# Altium project AQB-5-ANTON_TRANS-PWR.PrjPcb
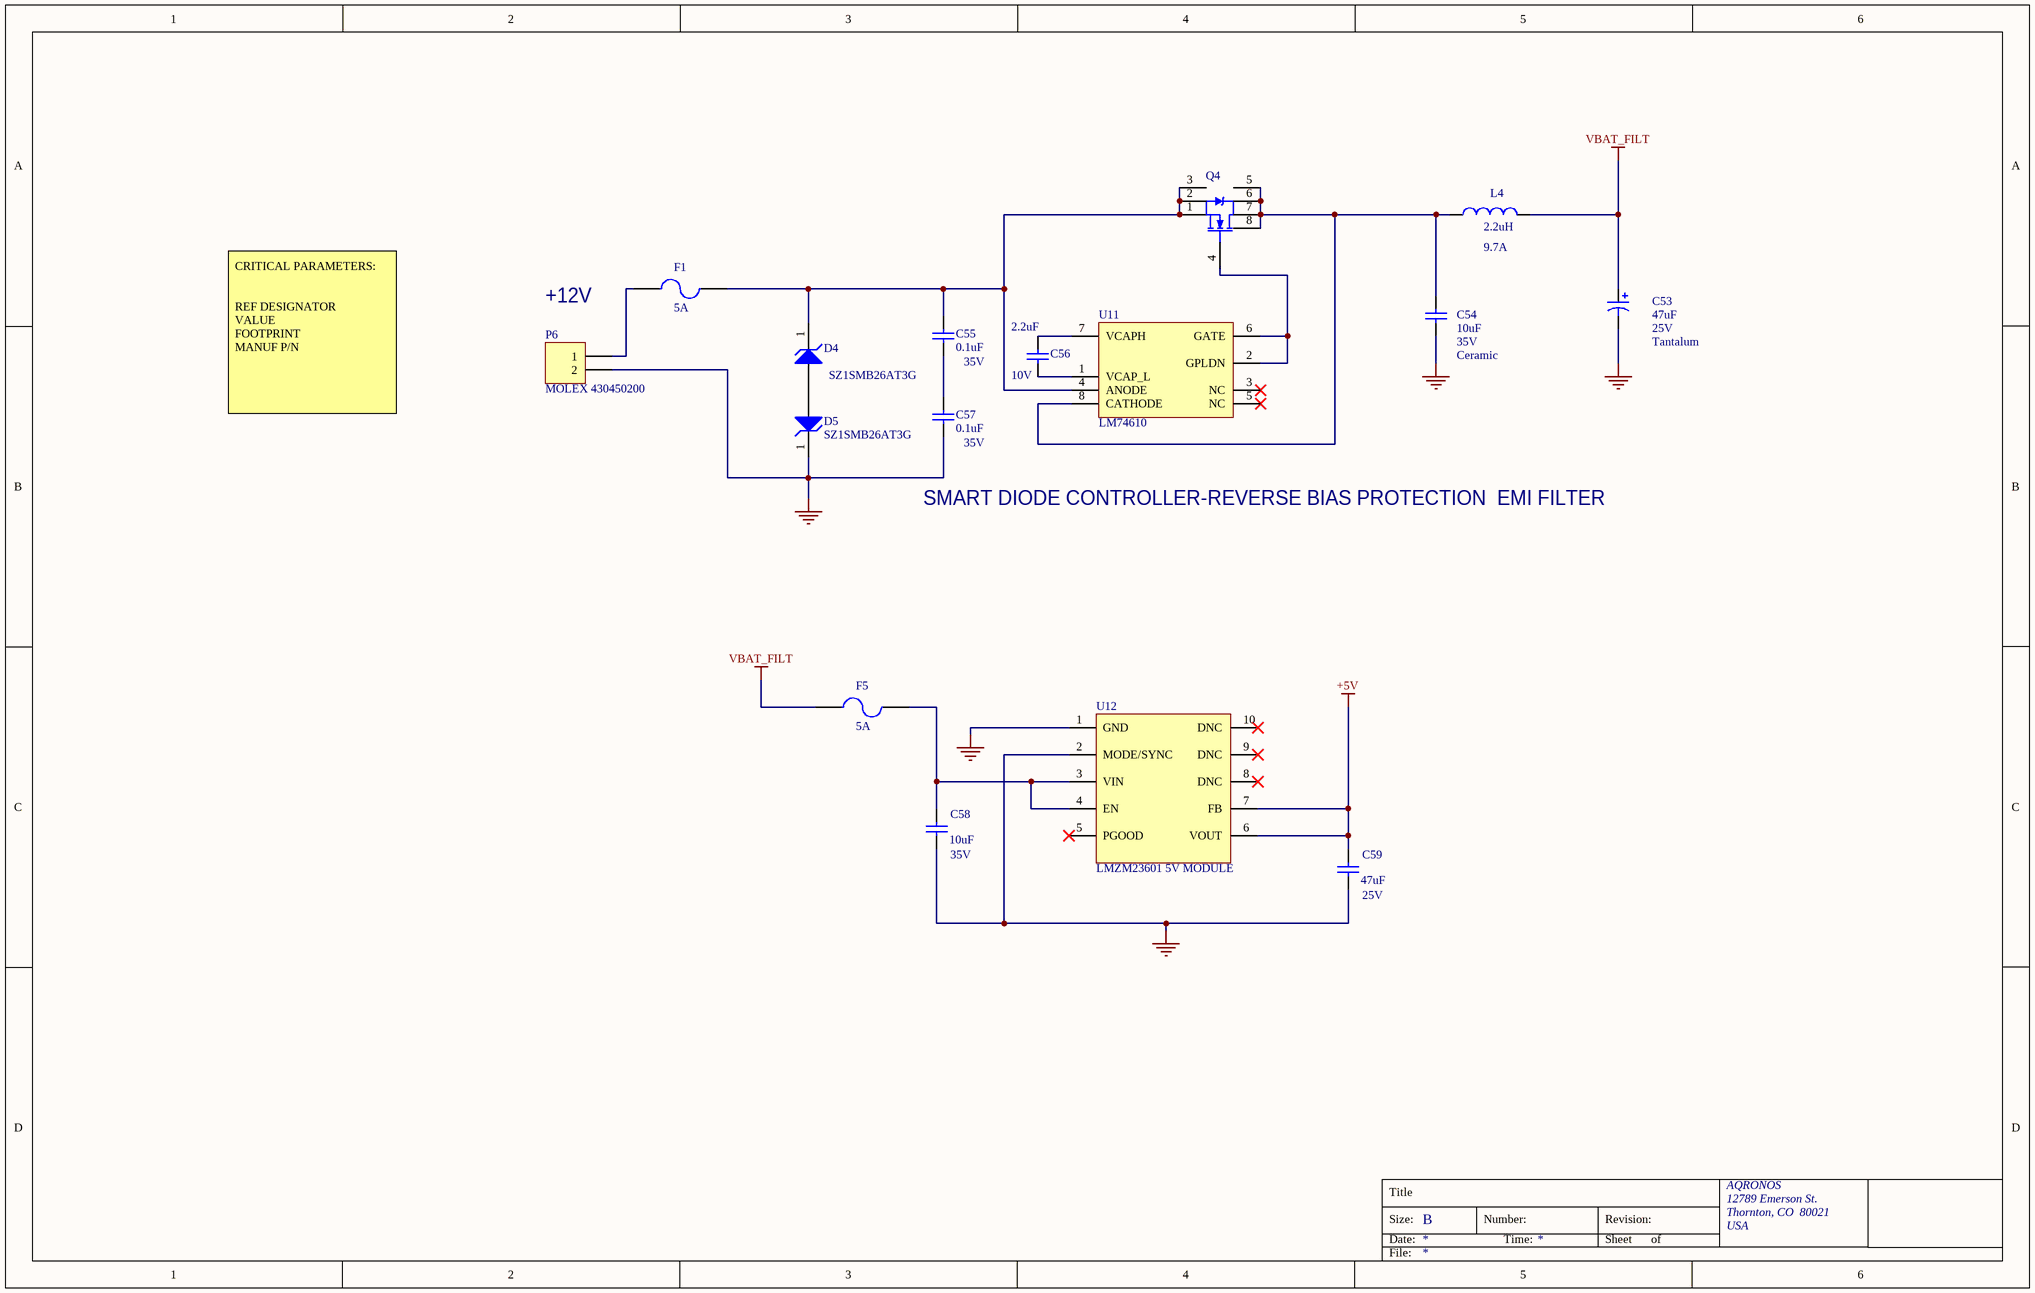
[diagram p0: -NEW_AQB-5-ANTON_TRANS-PWR-TVS.SchDoc]
4 sheets, 138 parts. Net scope: flat (ports and power ports of the same name join across sheets).
Board file: NEW-AQB-5-ANTON_TRANS-PWR.PcbDoc
Sheets:
  -NEW_AQB-5-ANTON_TRANS-PWR-TVS.SchDoc
  -NEW-AQB-5-ANTON_TRANS-PWR-GALVO.SchDoc
  -NEW-AQB-5-ANTON_TRANS-PWR-POLYGON.SchDoc
  -NEW-AQB-5-ANTON_TRANS-PWR_Motion-Controller.SchDoc

## Sheet -NEW_AQB-5-ANTON_TRANS-PWR-TVS.SchDoc
size B; Organization: AQRONOS; Address1: 12789 Emerson St.; Address2: Thornton, CO  80021; Address3: USA

### Parts
C53  Tantalum  value 47uF  Voltage: 25V  [C2917]
C54  Ceramic  value 10uF  Voltage: 35V  [CAP1206]
C55  value 0.1uF  Voltage: 35V  [CAP0603]  (hidden comment: Capacitor_non_pol)
C56  value 2.2uF  Voltage: 10V  [CAP0603]  (hidden comment: Capacitor_non_pol)
C57  value 0.1uF  Voltage: 35V  [CAP0603]  (hidden comment: Capacitor_non_pol)
C58  value 10uF  Voltage: 35V  [CAP1206]  (hidden comment: Capacitor_non_pol)
C59  value 47uF  Voltage: 25V  [CAP1206]  (hidden comment: Capacitor_non_pol)
D4  Manufacturer Part Number: SZ1SMB26AT3G  (hidden comment: Diode Zener)
D5  Manufacturer Part Number: SZ1SMB26AT3G  (hidden comment: Diode Zener)
F1  Current: 5A  [RES0603]  (hidden comment: Fuse)
F5  Current: 5A  [RES0603]  (hidden comment: Fuse)
L4  value 2.2uH  Current: 9.7A  (hidden comment: Inductor)
P6  MOLEX 430450200  [RA-HDR1X2]
Q4  CSD18531Q5A  (value not drawn)
U11  LM74610  [8-TSSOP-VSSOP]
U12  LMZM23601 5V MODULE

### Nets
+5V: C59.1 U12.6(VOUT) U12.7(FB)
GND: C53.2 C54.2 C57.1 C58.2 C59.2 D5.1(K) P6.2 U12.1(GND) U12.2(MODE/SYNC)
VBAT_FILT: C53.1 F5.1 L4.2
NetC54_1: C54.1 L4.1 Q4.5(D) Q4.6(D) Q4.7(D) Q4.8(D) U11.8(CATHODE)
NetC55_1: C55.1 C57.2
NetC55_2: C55.2 D4.1(K) F1.2 Q4.1(S) Q4.2(S) Q4.3(S) U11.4(ANODE)
NetC56_1: C56.1 U11.1(VCAP_L)
NetC56_2: C56.2 U11.7(VCAPH)
NetC58_1: C58.1 F5.2 U12.3(VIN) U12.4(EN)
NetD4_2: D4.2(A) D5.2(A)
NetF1_1: F1.1 P6.1
NetQ4_4: Q4.4(G) U11.2(GPLDN) U11.6(GATE)

Not connected (* = marked no-connect by the designer): U11 3(NC)* 5(NC)*; U12 5(PGOOD)* 8(DNC)* 9(DNC)* 10(DNC)*

### Notes on the sheet
- +12V
- CRITICAL PARAMETERS:
  REF DESIGNATOR
  VALUE
  FOOTPRINT
  MANUF P/N
- SMART DIODE CONTROLLER-REVERSE BIAS PROTECTION
- EMI FILTER
- Title
- Size:
- Date:
- B
- Number:
- Time:
- Revision:
- Sheet
- of
- File:

### Library data of the parts
C53 = Capacitor-Polarized: CAP TANT 47UF 20% 25V 2917; Manufacturer Part Number: TPSD476M025R0250; Distributor Part Number: 478-4120-1-ND; Footprint: 2917; HelpURL: *; P/N: *; Tolerance: *; Vendor: *; Current: *; Power: *; Manufacturer: *
C54 = Capacitor_non_pol: CAP CER 10UF 35V X7R 1206; Manufacturer Part Number: CGA5L1X7R1V106K160AC; Distributor Part Number: 445-174428-1-ND; Footprint: 1206; P/N: *; Tolerance: *; Vendor: *; Manufacturer: *; Power: *; Current: *
C55 C57 = Capacitor_non_pol: CAP CER 0.1UF 35V X7R 0603; Manufacturer Part Number: GMK107B7104KAHT; Distributor Part Number: 587-3354-1-ND; Footprint: 0603; P/N: *; Tolerance: *; Vendor: *; Manufacturer: *; Power: *; Current: *
C56 = Capacitor_non_pol: CAP CER 2.2UF 10V X7R 0603; Manufacturer Part Number: GRM188R71A225KE15D; Footprint: 0603; P/N: *; Tolerance: *; Vendor: *; Distributor Part Number: 490-4520-1-ND
C58 = Capacitor_non_pol: Manufacturer Part Number: C2012X5R1V106K085AC; Distributor Part Number: 445-14417-1-ND; Footprint: *; P/N: *; Tolerance: *; Vendor: *; Manufacturer: *; Power: *; Current: *
C59 = Capacitor_non_pol: Manufacturer Part Number: GRM31CR61E476ME44L; Distributor Part Number: 490-16268-1-ND; Footprint: *; P/N: *; Tolerance: *; Vendor: *; Manufacturer: *; Power: *; Current: *
D4 D5 = Diode Zener: TVS DIODE 26V 42.1V SMB; Published: 8-Jun-2000; LatestRevisionDate: 17-Jul-2002; LatestRevisionNote: Re-released for DXP Platform.; PackageReference: DIODE-0.7; Publisher: Altium Limited; Distributor Part Number: F11556CT-ND; Vendor: *; Voltage: *; Power: *; Current: *; Tolerance: *; Manufacturer: *; Footprint: DO-214AA SMB
F1 F5 = Fuse: FUSE BOARD MNT 5A 32VAC/VDC 0603; Manufacturer Part NUmber: TR/0603FA5-R; Manufacturer: Eaton; Published: 8-Jun-2000; LatestRevisionDate: 17-Jul-2002; LatestRevisionNote: Re-released for DXP Platform.; PackageReference: PIN-W2/E2.8; Publisher: Altium Limited; Vendor: *; Distributor Part Number: 283-2564-1-ND; Voltage: *; Power: *; Tolerance: *; Footprint: 0603
L4 = Inductor: Fixed Inductor 2.2uH 20% 9.7A 14.5mOhms AEC-Q200; Manufacturer: Coilcraft; Manufacturer Part Number: XAL5030-222MEB; Vendor: Mouser; Distributor Part Number: 994-XAL5030-222MEB; HelpURL: *; Tolerance: 20%; Voltage: *; Power: *
P6 = HDR1x2-430450200: Connector Header Through Hole, Right Angle 2 position; Manufacturer Part Number: 0430450200; Footprint: RA-HDR1x2; P/N: *; Tolerance: *; Value: *; Vendor: Molex; Distributor Part Number: WM1813-ND
Q4 = CSD18531Q5A: N-Channel 2.5V (G-S) MOSFET; Rule: PcbType=ProtelPcb; Published: 8-Jun-2000; LatestRevisionDate: 17-Jul-2002; LatestRevisionNote: Re-released for DXP Platform.; DatasheetVersion: 6-Oct-1997; PackageVersion: Aug-1998; PackageReference: TSOP-6; Publisher: Altium Limited; PackageDescription: SOT-457/SC-74; 6 Leads; Body 3.1 x 3 mm, inc. leads (LxW max); ComponentLink1Description: Manufacturer Link; ComponentLink1URL: http://www.vishay.com/; ComponentLink2Description: Datasheet; ComponentLink2URL: http://www.vishay.com/docs/70192/70192.pdf; Manufacturer Part Number: CSD18531Q5A; Distributor Part Number: 296-30573-1-ND; Footprint: TDFN-8
U11 = LM74610: IC SMART DIODE CTLR 8VSSOP; Manufacturer: Texas Instruments; Manufacturer Part Number: LM74610QDGKRQ1; Vendor: *; Distributor Part Number: 296-43067-1-ND; Power: *; Voltage: *; Footprint: 8-TSSOP, 8-MSOP (0.118", 3.00mm Width); Value: *; Tolerance: *
U12 = LMZM23601 5V MODULE: Manufacturer Part Number: LMZM23601V3SILT; Designator: U12; Distributor Part Number: 296-49461-1-ND; Footprint: 10-LDFN EXPOSED PAD

## Sheet -NEW-AQB-5-ANTON_TRANS-PWR-GALVO.SchDoc
size B; Organization: AQRONOS; Address1: 12789 Emerson St.; Address2: Thornton, CO  80021; Address3: USA
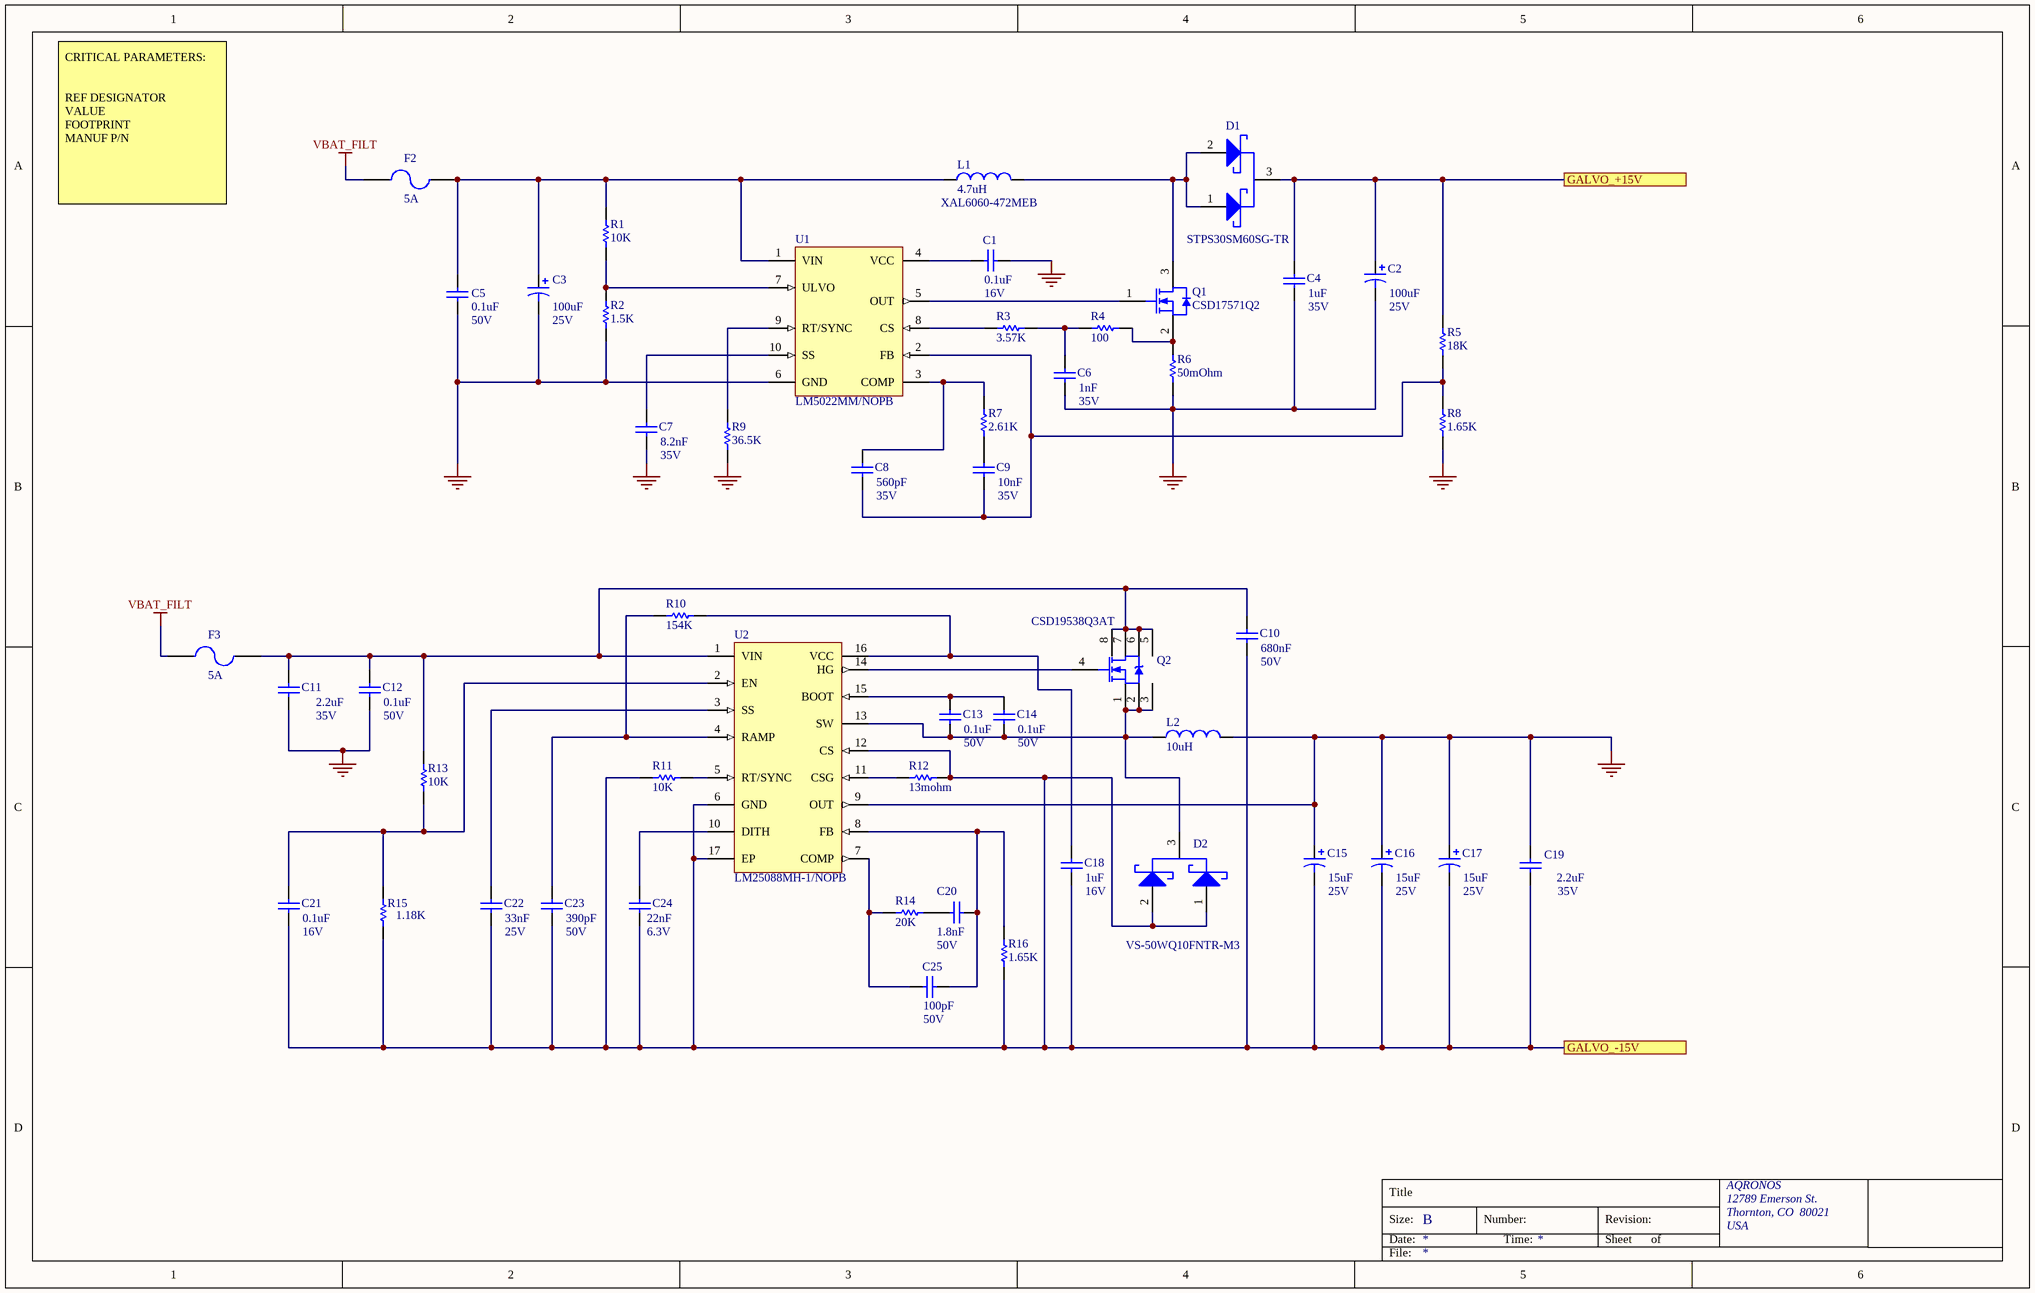
[diagram p1: -NEW-AQB-5-ANTON_TRANS-PWR-GALVO.SchDoc]

### Parts
C1  value 0.1uF  Voltage: 16V  [CAP0402]  (hidden comment: Capacitor_non_pol)
C2  value 100uF  Voltage: 25V  [EEE-FK1H470XP]  (hidden comment: Capacitor-Polarized)
C3  value 100uF  Voltage: 25V  (hidden comment: Capacitor-Polarized)
C4  value 1uF  Voltage: 35V  [CAP0402]  (hidden comment: Capacitor_non_pol)
C5  value 0.1uF  Voltage: 50V  [CAP0402]  (hidden comment: Capacitor_non_pol)
C6  value 1nF  Voltage: 35V  [CAP0402]  (hidden comment: Capacitor_non_pol)
C7  value 8.2nF  Voltage: 35V  [CAP0402]  (hidden comment: Capacitor_non_pol)
C8  value 560pF  Voltage: 35V  [CAP0402]  (hidden comment: Capacitor_non_pol)
C9  value 10nF  Voltage: 35V  [CAP0402]  (hidden comment: Capacitor_non_pol)
C10  value 680nF  Voltage: 50V  [CAP0603]  (hidden comment: Capacitor_non_pol)
C11  value 2.2uF  Voltage: 35V  [CAP0603]  (hidden comment: Capacitor_non_pol)
C12  value 0.1uF  Voltage: 50V  [CAP0805]  (hidden comment: Capacitor_non_pol)
C13  value 0.1uF  Voltage: 50V  [CAP0805]  (hidden comment: Capacitor_non_pol)
C14  value 0.1uF  Voltage: 50V  [CAP0805]  (hidden comment: Capacitor_non_pol)
C15  value 15uF  Voltage: 25V  [EEE-FK1H470XP]  (hidden comment: Capacitor-Polarized)
C16  value 15uF  Voltage: 25V  [EEE-FK1H470XP]  (hidden comment: Capacitor-Polarized)
C17  value 15uF  Voltage: 25V  [EEE-FK1H470XP]  (hidden comment: Capacitor-Polarized)
C18  value 1uF  Voltage: 16V  [CAP0603]  (hidden comment: Capacitor_non_pol)
C19  value 2.2uF  Voltage: 35V  [CAP0603]  (hidden comment: Capacitor_non_pol)
C20  value 1.8nF  Voltage: 50V  [CAP0805]  (hidden comment: Capacitor_non_pol)
C21  value 0.1uF  Voltage: 16V  [CAP0402]  (hidden comment: Capacitor_non_pol)
C22  value 33nF  Voltage: 25V  [CAP0402]  (hidden comment: Capacitor_non_pol)
C23  value 390pF  Voltage: 50V  [CAP0402]  (hidden comment: Capacitor_non_pol)
C24  value 22nF  Voltage: 6.3V  [CAP0402]  (hidden comment: Capacitor_non_pol)
C25  value 100pF  Voltage: 50V  [CAP0805]  (hidden comment: Capacitor_non_pol)
D1  Manufacturer Part Number: STPS30SM60SG-TR  [ONSC-D2PAK-3-418AJ_A_V]  (hidden comment: Schottky-3-Terminal)
D2  VS-50WQ10FNTR-M3  [ONSC-D2PAK-3-418AJ_A_V]
F2  Current: 5A  [RES0603]  (hidden comment: Fuse)
F3  Current: 5A  [RES0603]  (hidden comment: Fuse)
L1  4.7uH  Manufacturer Part Number: XAL6060-472MEB  [PA4320.104NLT]
L2  10uH  [PA4320.104NLT]
Q1  CSD17571Q2  [NXP-SOT23_N]
Q2  CSD19538Q3AT  [CSD18531Q5A-3D]
R1  value 10K  [RES0402]  (hidden comment: Resistor)
R2  value 1.5K  [RES0402]  (hidden comment: Resistor)
R3  value 3.57K  [RES0402]  (hidden comment: Resistor)
R4  value 100  [RES0402]  (hidden comment: Resistor)
R5  value 18K  [RES0603]  (hidden comment: Resistor)
R6  value 50mOhm  [RES1206]  (hidden comment: Resistor)
R7  value 2.61K  [RES0402]  (hidden comment: Resistor)
R8  value 1.65K  [RES0402]  (hidden comment: Resistor)
R9  value 36.5K  [RES0402]  (hidden comment: Resistor)
R10  value 154K  [RES0402]  (hidden comment: Resistor)
R11  value 10K  [RES0402]  (hidden comment: Resistor)
R12  value 13mohm  [RES0402]  (hidden comment: Resistor)
R13  value 10K  [RES0402]  (hidden comment: Resistor)
R14  value 20K  [RES0402]  (hidden comment: Resistor)
R15  value 1.18K  [RES0402]  (hidden comment: Resistor)
R16  value 1.65K  [RES0402]  (hidden comment: Resistor)
U1  LM5022MM/NOPB  [MUB10A_N]
U2  LM25088MH-1/NOPB  [MXA16A_N]

### Ports
GALVO_+15V, GALVO_-15V

### Nets
GND: C1.2 C2.2 C3.2 C4.2 C5.2 C6.2 C7.2 C11.2 C12.1 C15.1 C16.1 C17.1 C19.1 L2.2 R2.2 R6.1 R8.1 R9.2 U1.6(GND) U2.9(OUT)
VBAT_FILT: F2.1 F3.1
NetC1_1: C1.1 U1.4(VCC)
NetC2_1: C2.1 C4.1 D1.3(K) R5.1 ; port GALVO_+15V
NetC3_1: C3.1 C5.1 F2.2 L1.1 R1.1 U1.1(VIN)
NetC6_1: C6.1 R3.2 R4.1
NetC7_1: C7.1 U1.10(SS)
NetC8_1: C8.1 C9.1 R5.2 R8.2 U1.2(FB)
NetC8_2: C8.2 R7.2 U1.3(COMP)
NetC9_2: C9.2 R7.1
NetC10_1: C10.1 C11.1 C12.2 F3.2 Q2.5(D) Q2.6(D) Q2.7(D) Q2.8(D) R13.2 U2.1(VIN)
NetC10_2: C10.2 C15.2 C16.2 C17.2 C18.2 C19.2 C21.2 C22.2 C23.2 C24.2 D2.1(A) D2.2(A) R11.2 R12.2 R15.1 R16.1 U2.6(GND) U2.12(CS) U2.17(EP) ; port GALVO_-15V
NetC13_1: C13.1 C14.1 D2.3(K) L2.1 Q2.1(S) Q2.2(S) Q2.3(S) U2.13(SW)
NetC13_2: C13.2 C14.2 U2.15(BOOT)
NetC18_1: C18.1 R10.1 U2.16(VCC)
NetC20_1: C20.1 R14.1
NetC20_2: C20.2 C25.2 R16.2 U2.8(FB)
NetC21_1: C21.1 R13.1 R15.2 U2.2(EN)
NetC22_1: C22.1 U2.3(SS)
NetC23_1: C23.1 R10.2 U2.4(RAMP)
NetC24_1: C24.1 U2.10(DITH)
NetC25_1: C25.1 R14.2 U2.7(COMP)
NetD1_1: D1.1(A) D1.2(A) L1.2 Q1.3(D)
NetQ1_1: Q1.1(G) U1.5(OUT)
NetQ1_2: Q1.2(S) R4.2 R6.2
NetQ2_4: Q2.4(G) U2.14(HG)
NetR1_2: R1.2 R2.1 U1.7(ULVO)
NetR3_1: R3.1 U1.8(CS)
NetR9_1: R9.1 U1.9(RT/SYNC)
NetR11_1: R11.1 U2.5(RT/SYNC)
NetR12_1: R12.1 U2.11(CSG)

### Notes on the sheet
- CRITICAL PARAMETERS:
  REF DESIGNATOR
  VALUE
  FOOTPRINT
  MANUF P/N
- Title
- Size:
- Date:
- B
- Number:
- Time:
- Revision:
- Sheet
- of
- File:

### Library data of the parts
C1 C21 = Capacitor_non_pol: CAP CER 0.1UF 16V X7R 0402; Manufacturer Part Number: GRM155R71C104KA88D; Distributor Part Number: 490-3261-1-ND; Footprint: *; P/N: *; Tolerance: *; Vendor: *; Manufacturer: *; Power: *; Current: *; Supplier Part Number 1: 490-3261-1-ND
C2 = Capacitor-Polarized: CAP ALUM POLY 100UF 20% 25V SMD; Manufacturer Part Number: 25SVPF100M; Distributor Part Number: P123675CT-ND; Footprint: *; HelpURL: *; P/N: *; Tolerance: *; Vendor: *; Current: *; Power: *; Manufacturer: *; Supplier Part Number 1: P123675CT-ND
C3 = Capacitor-Polarized: CAP ALUM POLY HYB 100UF 25V SMD; Manufacturer Part Number: EEHZA1E101XP; Distributor Part Number: P15436CT-ND; Footprint: SMT Radial Can; HelpURL: *; P/N: *; Tolerance: *; Vendor: *; Current: *; Power: *; Manufacturer: *; Supplier Part Number 1: P15436CT-ND
C4 = Capacitor_non_pol: CAP CER 1UF 35V X5R 0402; Manufacturer Part Number: C1005X5R1V105K050BC; Distributor Part Number: 445-9073-1-ND; Footprint: *; P/N: *; Tolerance: *; Vendor: *; Manufacturer: *; Power: *; Current: *; Supplier Part Number 1: 445-9073-1-ND; Vendor Part Number: *
C5 = Capacitor_non_pol: CAP CER 0.1UF 50V X5R 0402; Manufacturer Part Number: C1005X5R1H104K050BB; Distributor Part Number: 445-5942-1-ND; Footprint: 0402; P/N: *; Tolerance: *; Vendor: *; Manufacturer: *; Power: *; Current: *; Supplier Part Number 1: 445-5942-1-ND
C6 = Capacitor_non_pol: CAP CER 1000PF 50V C0G/NP0 0402; Manufacturer Part Number: GRM1555C1H102JA01J; Distributor Part Number: 490-6190-1-ND; Footprint: *; P/N: *; Tolerance: *; Vendor: *; Manufacturer: *; Power: *; Current: *; Supplier Part Number 1: 490-6190-1-ND
C7 = Capacitor_non_pol: CAP CER 8200PF 25V X7R 0402; Manufacturer Part Number: GRM155R71E822KA01D; Distributor Part Number: 490-1311-1-ND; Footprint: 0402; P/N: *; Tolerance: *; Vendor: *; Manufacturer: *; Power: *; Current: *; Supplier Part Number 1: 490-1311-1-ND
C8 = Capacitor_non_pol: CAP CER 560PF 50V C0G/NP0 0402; Manufacturer Part Number: GRM1555C1H561JA01J; Distributor Part Number: 490-6248-1-ND; Footprint: *; P/N: *; Tolerance: *; Vendor: *; Manufacturer: *; Power: *; Current: *; Supplier Part Number 1: 490-6248-1-ND
C9 = Capacitor_non_pol: CAP CER 10000PF 35V X7R 0402; Manufacturer Part Number: CGA2B3X7R1V103K050BB; Distributor Part Number: 445-6900-1-ND; Footprint: *; P/N: *; Tolerance: *; Vendor: *; Manufacturer: *; Power: *; Current: *; Supplier Part Number 1: 445-6900-1-ND
C10 = Capacitor_non_pol: CAP CER 0.68UF 50V X5R 0603; Manufacturer Part Number: C1608X5R1H684K080AB; Distributor Part Number: 445-12509-1-ND; Footprint: *; P/N: *; Tolerance: *; Vendor: *; Manufacturer: *; Power: *; Current: *; Supplier Part Number 1: 445-12509-1-ND
C11 C19 = Capacitor_non_pol: CAP CER 2.2UF 35V X5R 0603; Manufacturer Part Number: C1608X5R1V225K080AC; Distributor Part Number: 445-8025-1-ND; Footprint: *; P/N: *; Tolerance: *; Vendor: *; Manufacturer: *; Power: *; Current: *; Supplier Part Number 1: 445-8025-1-ND
C12-C14 = Capacitor_non_pol: CAP CER 0.1UF 50V X7R 0805; Manufacturer Part Number: CC0805KRX7R9BB104; Distributor Part Number: 311-1140-1-ND; Footprint: *; P/N: *; Tolerance: *; Vendor: *; Manufacturer: *; Power: *; Current: *; Supplier Part Number 1: 311-1140-1-ND
C15-C17 = Capacitor-Polarized: CAP ALUM POLY 15UF 20% 25V SMD; Manufacturer Part Number: 25SVPG15M; Distributor Part Number: P18932CT-ND; Footprint: *; HelpURL: *; P/N: *; Tolerance: *; Vendor: *; Current: *; Power: *; Manufacturer: *; Supplier Part Number 1: P18932CT-ND
C18 = Capacitor_non_pol: CAP CER 1UF 16V X7R 0603; Manufacturer Part Number: EMK107B7105KA-T; Distributor Part Number: 587-1241-1-ND; Footprint: *; P/N: *; Tolerance: *; Vendor: *; Manufacturer: *; Power: *; Current: *; Supplier Part Number 1: 587-1241-1-ND
C20 = Capacitor_non_pol: CAP CER 1800PF 50V C0G 0805; Manufacturer Part Number: CGA4C2C0G1H182J060AA; Distributor Part Number: 445-12616-1-ND; Footprint: *; P/N: *; Tolerance: *; Vendor: *; Manufacturer: *; Power: *; Current: *; Supplier Part Number 1: 445-12616-1-ND
C22 = Capacitor_non_pol: CAP CER 0.033UF 25V X7R 0402; Manufacturer Part Number: GRM155R71E333KA88D; Distributor Part Number: 490-3253-1-ND; Footprint: *; P/N: *; Tolerance: *; Vendor: *; Manufacturer: *; Power: *; Current: *; Supplier Part Number 1: 490-3253-1-ND
C23 = Capacitor_non_pol: CAP CER 390PF 50V C0G/NP0 0402; Manufacturer Part Number: GRM1555C1H391JA01J; Distributor Part Number: 490-6236-1-ND; Footprint: *; P/N: *; Tolerance: *; Vendor: *; Manufacturer: *; Power: *; Current: *; Supplier Part Number 1: 490-6236-1-ND
C24 = Capacitor_non_pol: AP CER 0.022UF 6.3V X5R 0402; Manufacturer Part Number: C0402C223K9PACTU; Distributor Part Number: 399-3014-1-ND; Footprint: *; P/N: *; Tolerance: *; Vendor: *; Manufacturer: *; Power: *; Current: *; Supplier Part Number 1: 399-3014-1-ND
C25 = Capacitor_non_pol: CAP CER 100PF 50V C0G/NP0 0805; Manufacturer Part Number: CL21C101JBANNNC; Distributor Part Number: 1276-1014-1-ND; Footprint: *; P/N: *; Tolerance: *; Vendor: *; Manufacturer: *; Power: *; Current: *; Supplier Part Number 1: 1276-1014-1-ND
D1 = Schottky-3-Terminal: DIODE SCHOTTKY 60V 30A D2PAK; Manufacturer: On Semiconductor; PartNumber: SZP6SMB20AT3G; Direction: Unidirectional; IR Max (uA): 5; Packing: Tape and Reel; PPK Max (W): 600; V(BR) Typ (V): 20; DatasheetVersion: Rev. J; PackageVersion: Rev. J, 07/2012; PackageReference: SMB-2-403A-03_J; PackageDescription: 2-Pin Small Molded Package, J-Bend Lead, Body 4.33 x 3.625 mm; Supplier 1: Digi-Key; Supplier Part Number 1: 497-12329-1-ND; Supplier 2: Mouser; Supplier Part Number 2: 497-12329-1-ND; RoHS: Pb-Free; Mounting Technology: Surface Mount; ComponentLink1Description: Manufacturer URL; ComponentLink1URL: http://www.onsemi.com/; ComponentLink2Description: Datasheet; ComponentLink2URL: http://www.onsemi.com/pub_link/Collateral/P6SMB6.8AT3-D.PDF; ComponentLink3Description: Package Specification; ComponentLink3URL: http://www.onsemi.com/pub_link/Collateral/P6SMB6.8AT3-D.PDF; Distributor Part Number: 497-12329-1-ND; Footprint: D2PAK
D2 = Schottky-3-Terminal: Manufacturer: On Semiconductor; Direction: Unidirectional; IR Max (uA): 5; Packing: Tape and Reel; PPK Max (W): 600; V(BR) Typ (V): 20; DatasheetVersion: Rev. J; PackageVersion: Rev. J, 07/2012; PackageReference: SMB-2-403A-03_J; PackageDescription: 2-Pin Small Molded Package, J-Bend Lead, Body 4.33 x 3.625 mm; Supplier 1: Digi-Key; Supplier Part Number 1: VS-50WQ10FNTR-M3CT-ND; Supplier 2: Mouser; Supplier Part Number 2: VS-50WQ10FNTR-M3CT-ND; RoHS: Pb-Free; Mounting Technology: Surface Mount; PartNumber: VS-50WQ10FNTR-M3; ComponentLink1Description: Manufacturer URL; ComponentLink1URL: http://www.onsemi.com/; ComponentLink2Description: Datasheet; ComponentLink2URL: http://www.onsemi.com/pub_link/Collateral/P6SMB6.8AT3-D.PDF; ComponentLink3Description: Package Specification; ComponentLink3URL: http://www.onsemi.com/pub_link/Collateral/P6SMB6.8AT3-D.PDF; Manufacturer Part Number: VS-50WQ10FNTR-M3; Distributor Part Number: VS-50WQ10FNTR-M3CT-ND
F2 F3 = Fuse: as F1 on sheet -NEW_AQB-5-ANTON_TRANS-PWR-TVS; Published: 8-Jun-2000; LatestRevisionDate: 17-Jul-2002; LatestRevisionNote: Re-released for DXP Platform.; PackageReference: PIN-W2/E2.8; Publisher: Altium Limited; Vendor: *; Distributor Part Number: 283-2564-1-ND; Voltage: *; Power: *; Tolerance: *; Footprint: 0603
L1 = Inductor: Fixed Inductors 4.7uH 20% 11A 14.40mOhms AEC-Q200; Vendor: MOUSER; Distributor Part Number: 994-XAL6060-472MEB; Footprint: *; HelpURL: *; Manufacturer: *; Tolerance: *; Value: *; Current: 11A; Voltage: *; Power: *
L2 = Inductor: FIXED IND 10UH 5A 21 MOHM SMD; Manufacturer Part Number: SRR1208-100ML; Vendor: DIGIKEY; Distributor Part Number: SRR1208-100MLCT-ND; Footprint: *; HelpURL: *; Manufacturer: *; Tolerance: *; Value: *; Current: 5A; Voltage: *; Power: *
Q1 = BSS138P,215: N-Channel Trench MOSFET, 60 V, 0.36 A, -55 to 150 degC, 3-Pin SOT23, Tape and Reel; Manufacturer: NXP Semiconductors; Automotive Qualified: Y; Channel Type: N; ID [max] (A): 0.36; IDM [max] (A): 1.2; Packing: Tape & Reel; VDS [max] (V): 60; DatasheetVersion: Rev. 1; PackageVersion: 06-03-16, 03/2006; PackageReference: SOT23; PackageDescription: 3-Pin Small Outline Transistor Package, Body 2.9 x 1.3 mm, Pitch 0.95 mm; Supplier 1: Digi-Key; Supplier Part Number 1: 568-10308-2-ND; Supplier 2: Digi-Key; Supplier Part Number 2: 568-10308-1-ND; Supplier 3: Digi-Key; Supplier Part Number 3: 568-10308-6-ND; Supplier 4: Newark; Supplier Part Number 4: 54T9070; Supplier 5: Mouser; Supplier Part Number 5: 771-BSS138P215; VGSth [typ] (V): 1.2; Mounting Technology: Surface Mount; Code_JEDEC: TO-236AB; PartNumber: BSS138P,215; ComponentLink1Description: Manufacturer URL; ComponentLink1URL: http://www.nxp.com/; ComponentLink2Description: Datasheet; ComponentLink2URL: http://www.nxp.com/documents/data_sheet/BSS138P.pdf; ComponentLink3Description: Package Specification; ComponentLink3URL: http://www.nxp.com/documents/outline_drawing/sot023_po.pdf; Manufacturer Part Number: CSD17571Q2; Distributor Part Number: 296-37193-1-ND
Q2 = CSD18531Q5A: MOSFET N-CH 100V 15A VSONP; Published: 8-Jun-2000; LatestRevisionDate: 17-Jul-2002; LatestRevisionNote: Re-released for DXP Platform.; DatasheetVersion: 6-Oct-1997; PackageVersion: Aug-1998; PackageReference: VSONP; Publisher: Altium Limited; PackageDescription: SOT-457/SC-74; 6 Leads; Body 3.1 x 3 mm, inc. leads (LxW max); ComponentLink1Description: Manufacturer Link; ComponentLink1URL: http://www.vishay.com/; ComponentLink2Description: Datasheet; ComponentLink2URL: http://www.vishay.com/docs/70192/70192.pdf; Manufacturer Part Number: CSD19538Q3A; Supplier Part Number: 296-44473-1-ND; Distributor Part Number: 296-44473-1-ND
R1 = Resistor: RES SMD 10K OHM 0.5% 1/16W 0402; Manufacturer Part Number: ERA-2AED103X; Distributor Part Number: P10KDECT-ND; Footprint: 0402; HelpURL: *; P/N: *; Tolerance: *; Vendor: *; Voltage: *; Power: *; Current: *; Manufacturer: *; Supplier Part Number 1: P10KDECT-ND
R2 = Resistor: RES SMD 1.5K OHM 1% 1/5W 0402; Manufacturer Part Number: CRCW04021K50FKED; Distributor Part Number: 541-1.50KYCT-ND; Footprint: 0402; HelpURL: *; P/N: *; Tolerance: *; Vendor: *; Voltage: *; Power: *; Current: *; Manufacturer: *; Supplier Part Number 1: 541-1.50KYCT-ND
R3 = Resistor: RES SMD 3.57K OHM 1% 1/16W 0402; Manufacturer Part Number: CRCW04023K57FKED; Distributor Part Number: 541-3.57KLCT-ND; Footprint: *; HelpURL: *; P/N: *; Tolerance: *; Vendor: *; Voltage: *; Power: *; Current: *; Manufacturer: *; Supplier Part Number 1: 541-3.57KLCT-ND
R4 = Resistor: RES SMD 100 OHM 1% 1/16W 0402; Manufacturer Part Number: CRCW0402100RFKED; Distributor Part Number: 541-100LCT-ND; Footprint: *; HelpURL: *; P/N: *; Tolerance: *; Vendor: *; Voltage: *; Power: *; Current: *; Manufacturer: *; Supplier Part Number 1: 541-100LCT-ND
R5 = Resistor: RES SMD 18K OHM 1% 1/10W 0603; Manufacturer Part Number: RC0603FR-0718KL; Distributor Part Number: 311-18.0KHRCT-ND; Footprint: *; HelpURL: *; P/N: *; Vendor: *; Voltage: *; Power: *; Current: *; Manufacturer: *; Supplier Part Number 1: 311-18.0KHRCT-ND
R6 = Resistor: RES 0.05 OHM 1% 1/2W 1206; Manufacturer Part Number: CSR1206FK50L0; Distributor Part Number: CSR1206FK50L0CT-ND; Footprint: *; HelpURL: *; P/N: *; Tolerance: *; Vendor: *; Voltage: *; Power: *; Current: *; Manufacturer: *; Supplier Part Number 1: CSR1206FK50L0CT-ND
R7 = Resistor: RES SMD 2.61K OHM 1% 1/16W 0402; Manufacturer Part Number: CRCW04022K61FKED; Distributor Part Number: 541-2.61KLCT-ND; Footprint: *; HelpURL: *; P/N: *; Tolerance: *; Vendor: *; Voltage: *; Power: *; Current: *; Manufacturer: *; Supplier Part Number 1: 541-2.61KLCT-ND
R8 R16 = Resistor: RES SMD 1.65K OHM 1% 1/16W 0402; Manufacturer Part Number: RCW04021K65FKED; Distributor Part Number: 541-1.65KLCT-ND; Footprint: *; HelpURL: *; P/N: *; Tolerance: *; Vendor: *; Voltage: *; Power: *; Current: *; Manufacturer: *; Supplier Part Number 1: 541-1.65KLCT-ND
R9 = Resistor: RES SMD 36.5KOHM 0.1% 1/16W 0402; Manufacturer Part Number: ERA-2AEB3652X; Distributor Part Number: P36.5KDCCT-ND; Footprint: 0402; HelpURL: *; P/N: *; Tolerance: *; Vendor: *; Voltage: *; Power: *; Current: *; Manufacturer: *; Supplier Part Number 1: P36.5KDCCT-ND
R10 = Resistor: Manufacturer Part Number: CRCW0402154KFKED; Distributor Part Number: 541-154KLCT-ND; Footprint: *; HelpURL: *; P/N: *; Tolerance: *; Vendor: *; Voltage: *; Power: *; Current: *; Manufacturer: *
R11 R13 = Resistor: Manufacturer Part Number: RC0201FR-0710KL; Distributor Part Number: 311-10.0KMCT-ND; Footprint: *; HelpURL: *; P/N: *; Tolerance: *; Vendor: *; Voltage: *; Power: *; Current: *; Manufacturer: *
R12 = Resistor: Manufacturer Part Number: PRL1632-R013-F-T1; Distributor Part Number: PRL1632.013FCT-ND; Footprint: *; HelpURL: *; P/N: *; Tolerance: *; Vendor: *; Voltage: *; Power: *; Current: *; Manufacturer: *
R14 = Resistor: RES SMD 1.65K OHM 1% 1/16W 0402; Manufacturer Part Number: CRCW040220K0FKED; Distributor Part Number: 541-1.65KLCT-ND; Footprint: *; HelpURL: *; P/N: *; Tolerance: *; Vendor: *; Voltage: *; Power: *; Current: *; Manufacturer: *; Supplier Part Number 1: 541-1.65KLCT-ND
R15 = Resistor: Manufacturer Part Number: CRCW04021K18FKED; Distributor Part Number: 541-1.18KLCT-ND; Footprint: *; HelpURL: *; P/N: *; Tolerance: *; Vendor: *; Voltage: *; Power: *; Current: *; Manufacturer: *
U1 = LM5022MM/NOPB: 60V Low Side Controller for Boost and SEPIC, 10-pin MSOP, Pb-Free; Manufacturer: National Semiconductor; PackageTopMarking: ZXTT*5022; PowerWise: Y; CompType: Switcher; DatasheetVersion: Oct-2009; PackageVersion: revB, Jul-2003; PackageReference: MUB10A; PackageDescription: Mini-SO, Molded, .118 x .118 x .034in Body, 10 Lead, .0197in Pitch; Manufacturer Part Number: LM5022MM/NOPB; RoHS: Y; PinCount: 10; High-Reliability: Y; Code_JEDEC: MO-187-BA; ComponentLink1Description: Manufacturer URL; ComponentLink1URL: http://www.national.com/; ComponentLink2Description: LM5022 Datasheet; ComponentLink2URL: http://www.national.com/ds/LM/LM5022.pdf; ComponentLink3Description: LM5022 Web Page; ComponentLink3URL: http://www.national.com/pf/LM/LM5022.html; ComponentLink4Description: MUB10A Package Page; ComponentLink4URL: http://www.national.com/packaging/folders/mub10a.html; Distributor Part Number: LM5022MM/NOPBCT-ND
U2 = LM25088MH-1/NOPB: Wide Input Range Non-Synchronous Buck Controller, 16-pin TSSOP-EP, Pb-Free; Manufacturer: National Semiconductor; PackageTopMarking: NSUZXYTT*L25088*MH-1; PowerWise: Y; CompType: MiscPower; DatasheetVersion: Mar-2011; PackageVersion: revA, Apr-2003; PackageReference: MXA16A; PackageDescription: Molded TSSOP, Jedec, Exposed Pad, 5.0 x 4.4 x 0.9mm Body,16 Lead, 0.65mm Pitch; Manufacturer Part Number: LM25088MH-1/NOPB; RoHS: Y; PinCount: 16; High-Reliability: Y; Code_JEDEC: MO-153-ABT; ComponentLink1Description: Manufacturer URL; ComponentLink1URL: http://www.national.com/; ComponentLink2Description: LM25088 Datasheet; ComponentLink2URL: http://www.national.com/ds/LM/LM25088.pdf; ComponentLink3Description: LM25088 Web Page; ComponentLink3URL: http://www.national.com/pf/LM/LM25088.html; ComponentLink4Description: MXA16A Package Page; ComponentLink4URL: http://www.national.com/packaging/folders/mxa16a.html; Distributor Part Number: LM25088MH-1/NOPB-ND

## Sheet -NEW-AQB-5-ANTON_TRANS-PWR-POLYGON.SchDoc
size B; Organization: AQRONOS; Address1: 12789 Emerson St.; Address2: Thornton, CO  80021; Address3: USA
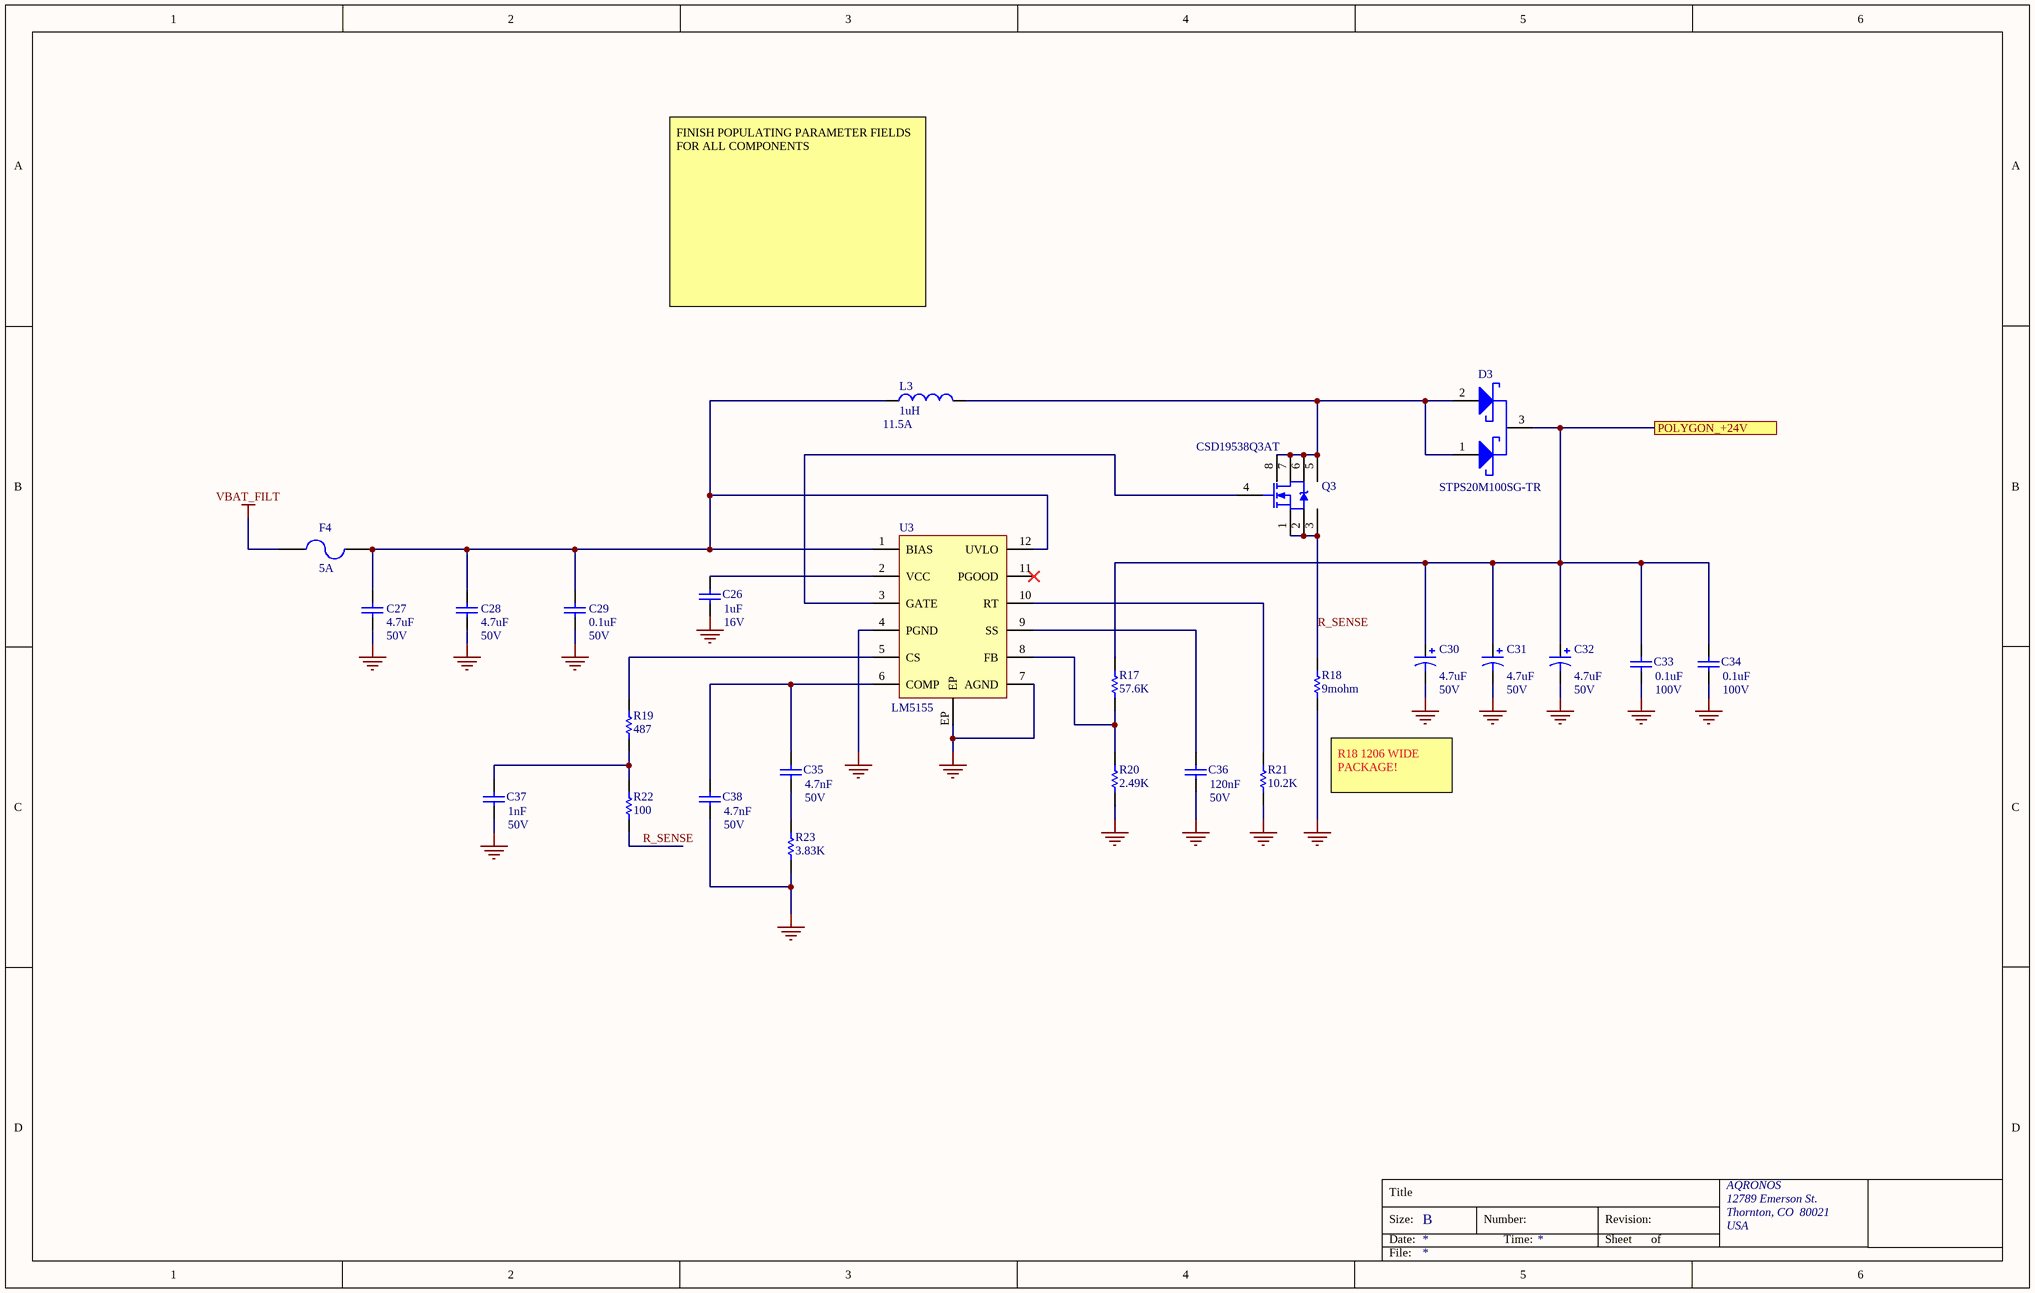
[diagram p2: -NEW-AQB-5-ANTON_TRANS-PWR-POLYGON.SchDoc]

### Parts
C26  value 1uF  Voltage: 16V  [CAP0603]  (hidden comment: Capacitor_non_pol)
C27  value 4.7uF  Voltage: 50V  [CAP0805]  (hidden comment: Capacitor_non_pol)
C28  value 4.7uF  Voltage: 50V  [CAP0805]  (hidden comment: Capacitor_non_pol)
C29  value 0.1uF  Voltage: 50V  [CAP0402]  (hidden comment: Capacitor_non_pol)
C30  value 4.7uF  Voltage: 50V  [CAP1206]  (hidden comment: Capacitor-Polarized)
C31  value 4.7uF  Voltage: 50V  [CAP1206]  (hidden comment: Capacitor-Polarized)
C32  value 4.7uF  Voltage: 50V  [CAP1206]  (hidden comment: Capacitor-Polarized)
C33  value 0.1uF  Voltage: 100V  [CAP0603]  (hidden comment: Capacitor_non_pol)
C34  value 0.1uF  Voltage: 100V  [CAP0603]  (hidden comment: Capacitor_non_pol)
C35  value 4.7nF  Voltage: 50V  [CAP0603]  (hidden comment: Capacitor_non_pol)
C36  value 120nF  Voltage: 50V  [CAP0402]  (hidden comment: Capacitor_non_pol)
C37  value 1nF  Voltage: 50V  [CAP0402]  (hidden comment: Capacitor_non_pol)
C38  value 4.7nF  Voltage: 50V  [CAP0603]  (hidden comment: Capacitor_non_pol)
D3  Manufacturer Part Number: STPS20M100SG-TR  [ONSC-D2PAK-3-418AJ_A_V]  (hidden comment: Schottky-3-Terminal)
F4  Current: 5A  [RES0603]  (hidden comment: Fuse)
L3  1uH  Current: 11.5A  [PA4320.104NLT]
Q3  CSD19538Q3AT  [CSD18531Q5A-3D]
R17  value 57.6K  [RES0402]  (hidden comment: Resistor)
R18  value 9mohm  (hidden comment: Resistor)
R19  value 487  [RES0402]  (hidden comment: Resistor)
R20  value 2.49K  [RES0402]  (hidden comment: Resistor)
R21  value 10.2K  [RES0402]  (hidden comment: Resistor)
R22  value 100  [RES0402]  (hidden comment: Resistor)
R23  value 3.83K  [RES0603]  (hidden comment: Resistor)
U3  LM5155  [LM155 WSON]

### Ports
POLYGON_+24V

### Nets
GND: C26.2 C27.2 C28.2 C29.2 C30.2 C31.2 C32.2 C33.2 C34.2 C36.2 C37.2 C38.2 R18.1 R20.2 R21.2 R23.2 U3.4(PGND) U3.7(AGND) U3.EP
VBAT_FILT: F4.1
R_SENSE: Q3.1(S) Q3.2(S) Q3.3(S) R18.2 R22.2
NetC26_1: C26.1 U3.2(VCC)
NetC27_1: C27.1 C28.1 C29.1 F4.2 L3.1 U3.1(BIAS) U3.12(UVLO)
NetC30_1: C30.1 C31.1 C32.1 C33.1 C34.1 D3.3(K) R17.1 ; port POLYGON_+24V
NetC35_1: C35.1 C38.1 U3.6(COMP)
NetC35_2: C35.2 R23.1
NetC36_1: C36.1 U3.9(SS)
NetC37_1: C37.1 R19.1 R22.1
NetD3_1: D3.1(A) D3.2(A) L3.2 Q3.5(D) Q3.6(D) Q3.7(D) Q3.8(D)
NetQ3_4: Q3.4(G) U3.3(GATE)
NetR17_2: R17.2 R20.1 U3.8(FB)
NetR19_2: R19.2 U3.5(CS)
NetR21_1: R21.1 U3.10(RT)

Not connected (* = marked no-connect by the designer): U3 11(PGOOD)*

### Notes on the sheet
- FINISH POPULATING PARAMETER FIELDS FOR ALL COMPONENTS
- R18 1206 WIDE PACKAGE!
- Title
- Size:
- Date:
- B
- Number:
- Time:
- Revision:
- Sheet
- of
- File:

### Library data of the parts
C26 = Capacitor_non_pol: as C18 on sheet -NEW-AQB-5-ANTON_TRANS-PWR-GALVO; Distributor Part Number: 587-1241-1-ND; Footprint: *; P/N: *; Tolerance: *; Vendor: *; Manufacturer: *; Power: *; Current: *; Supplier Part Number 1: 587-1241-1-ND
C27 C28 = Capacitor_non_pol: CAP CER 4.7UF 50V X5R 0805; Manufacturer Part Number: C2012X5R1H475K125AB; Distributor Part Number: 445-5980-1-ND; Footprint: *; P/N: *; Tolerance: *; Vendor: *; Manufacturer: *; Power: *; Current: *; Supplier Part Number 1: 445-5980-1-ND
C29 = Capacitor_non_pol: as C5 on sheet -NEW-AQB-5-ANTON_TRANS-PWR-GALVO; Distributor Part Number: 445-5942-1-ND; Footprint: *; P/N: *; Tolerance: *; Vendor: *; Manufacturer: *; Power: *; Current: *; Supplier Part Number 1: 445-5942-1-ND
C30-C32 = Capacitor-Polarized: CAP CER 4.7UF 50V X7R 1206; Manufacturer Part Number: C2012X5R1H475K125AB; Distributor Part Number: 490-6521-1-ND; Footprint: *; HelpURL: *; P/N: *; Tolerance: *; Vendor: *; Current: *; Power: *; Manufacturer: *
C33 C34 = Capacitor_non_pol: CAP CER 0.1UF 100V X7R 0603; Manufacturer Part Number: GRM188R72A104KA35D; Distributor Part Number: 490-3285-1-ND; Footprint: *; P/N: *; Tolerance: *; Vendor: *; Manufacturer: *; Power: *; Current: *
C35 C38 = Capacitor_non_pol: CAP CER 4700PF 50V C0G 0603; Manufacturer Part Number: CGA3E2C0G1H472J080AA; Distributor Part Number: 445-6912-1-ND; Footprint: *; P/N: *; Tolerance: *; Vendor: *; Manufacturer: *; Power: *; Current: *; Supplier Part Number 1: 445-6912-1-ND
C36 = Capacitor_non_pol: Manufacturer Part Number: C1812C124J5GACTU; Distributor Part Number: 490-1311-1-ND; Footprint: *; P/N: *; Tolerance: *; Vendor: *; Manufacturer: *; Power: *; Current: *; Supplier Part Number 1: 490-1311-1-ND
C37 = Capacitor_non_pol: as C6 on sheet -NEW-AQB-5-ANTON_TRANS-PWR-GALVO; Distributor Part Number: 490-6190-1-ND; Footprint: *; P/N: *; Tolerance: *; Vendor: *; Manufacturer: *; Power: *; Current: *
D3 = Schottky-3-Terminal: DIODE SCHOTTKY 100V 20A D2PAK; Manufacturer: On Semiconductor; Direction: Unidirectional; IR Max (uA): 5; Packing: Tape and Reel; PPK Max (W): 600; V(BR) Typ (V): 20; DatasheetVersion: Rev. J; PackageVersion: Rev. J, 07/2012; PackageReference: SMB-2-403A-03_J; PackageDescription: 2-Pin Small Molded Package, J-Bend Lead, Body 4.33 x 3.625 mm; Supplier 1: Digi-Key; Supplier Part Number 1: 497-10993-1-ND; Supplier 2: Mouser; Supplier Part Number 2: 497-10993-1-ND; RoHS: Pb-Free; Mounting Technology: Surface Mount; PartNumber: STPS20M100SG-TR; ComponentLink1Description: Manufacturer URL; ComponentLink1URL: http://www.onsemi.com/; ComponentLink2Description: Datasheet; ComponentLink2URL: http://www.onsemi.com/pub_link/Collateral/P6SMB6.8AT3-D.PDF; ComponentLink3Description: Package Specification; ComponentLink3URL: http://www.onsemi.com/pub_link/Collateral/P6SMB6.8AT3-D.PDF; Distributor Part Number: 497-10993-1-ND
F4 = Fuse: as F1 on sheet -NEW_AQB-5-ANTON_TRANS-PWR-TVS; Published: 8-Jun-2000; LatestRevisionDate: 17-Jul-2002; LatestRevisionNote: Re-released for DXP Platform.; PackageReference: PIN-W2/E2.8; Publisher: Altium Limited; Vendor: *; Distributor Part Number: 283-2564-1-ND; Voltage: *; Power: *; Tolerance: *; Footprint: 0603
L3 = Inductor: Fixed Inductors 4.7uH 20% 11A 14.40mOhms AEC-Q200; Manufacturer Part Number: 744316100; Distributor Part Number: 732-6176-1-ND; Footprint: *; HelpURL: *; Manufacturer: *; Tolerance: *; Value: *; Voltage: *; Power: *
Q3 = CSD18531Q5A: Manufacturer Part Number: CSD18543Q3A; Published: 8-Jun-2000; LatestRevisionDate: 17-Jul-2002; LatestRevisionNote: Re-released for DXP Platform.; DatasheetVersion: 6-Oct-1997; PackageVersion: Aug-1998; PackageReference: VSONP; Publisher: Altium Limited; PackageDescription: SOT-457/SC-74; 6 Leads; Body 3.1 x 3 mm, inc. leads (LxW max); ComponentLink1Description: Manufacturer Link; ComponentLink1URL: http://www.vishay.com/; ComponentLink2Description: Datasheet; ComponentLink2URL: http://www.vishay.com/docs/70192/70192.pdf; Distributor Part Number: 296-45302-1-ND
R17 = Resistor: Manufacturer Part Number: RG1608P-5762-B-T5; Distributor Part Number: RG16P57.6KBCT-ND; Footprint: *; HelpURL: *; P/N: *; Tolerance: *; Vendor: *; Voltage: *; Power: *; Current: *; Manufacturer: *
R18 = Resistor: RES 0.009 OHM 1W 1206 WIDE; Manufacturer Part Number: PRL1632-R009-F-T1; Distributor Part Number: PRL1632.009FCT-ND; Footprint: *; HelpURL: *; P/N: *; Tolerance: *; Vendor: *; Voltage: *; Power: *; Current: *; Manufacturer: *
R19 = Resistor: RES SMD 487 OHM 1% 1/5W 0402; Manufacturer Part Number: CRCW0402487RFKED; Distributor Part Number: 541-487YCT-ND; Footprint: *; HelpURL: *; P/N: *; Tolerance: *; Vendor: *; Voltage: *; Power: *; Current: *; Manufacturer: *
R20 = Resistor: Manufacturer Part Number: RG1608P-2491-B-T5; Distributor Part Number: RG16P2.49KBCT-ND; Footprint: *; HelpURL: *; P/N: *; Tolerance: *; Vendor: *; Voltage: *; Power: *; Current: *; Manufacturer: *
R21 = Resistor: RES SMD 10.2KOHM 0.1% 1/16W 0402; Manufacturer Part Number: ERA-2AEB1022X; Distributor Part Number: P10.2KDCCT-ND; Footprint: *; HelpURL: *; P/N: *; Tolerance: *; Vendor: *; Voltage: *; Power: *; Current: *; Manufacturer: *
R22 = Resistor: as R4 on sheet -NEW-AQB-5-ANTON_TRANS-PWR-GALVO; Distributor Part Number: 541-100LCT-ND; Footprint: *; HelpURL: *; P/N: *; Tolerance: *; Vendor: *; Voltage: *; Power: *; Current: *; Manufacturer: *
R23 = Resistor: RES SMD 3.83KOHM 0.1% 1/10W 0603; Manufacturer Part Number: RT0603BRD073K83L; Distributor Part Number: YAG4549CT-ND; Footprint: *; HelpURL: *; P/N: *; Tolerance: *; Vendor: *; Voltage: *; Power: *; Current: *; Manufacturer: *; Supplier Part Number 1: P36.5KDCCT-ND
U3 = LM5155: 60V Low Side Controller for Boost and SEPIC, 10-pin MSOP, Pb-Free; Manufacturer Part Number: LM51551DSST; PowerWise: Y; CompType: Switcher; DatasheetVersion: Oct-2009; PackageVersion: revB, Jul-2003; PackageReference: MUB10A; PackageDescription: Mini-SO, Molded, .118 x .118 x .034in Body, 10 Lead, .0197in Pitch; RoHS: Y; PinCount: 10; High-Reliability: Y; Code_JEDEC: MO-187-BA; ComponentLink1Description: Manufacturer URL; ComponentLink1URL: http://www.national.com/; ComponentLink2Description: LM5022 Datasheet; ComponentLink2URL: http://www.national.com/ds/LM/LM5022.pdf; ComponentLink3Description: LM5022 Web Page; ComponentLink3URL: http://www.national.com/pf/LM/LM5022.html; ComponentLink4Description: MUB10A Package Page; ComponentLink4URL: http://www.national.com/packaging/folders/mub10a.html; Distributor Part Number: 296-53427-1-ND

## Sheet -NEW-AQB-5-ANTON_TRANS-PWR_Motion-Controller.SchDoc
size B; Organization: AQRONOS; Address1: 12789 Emerson St.; Address2: Thornton, CO  80021; Address3: USA
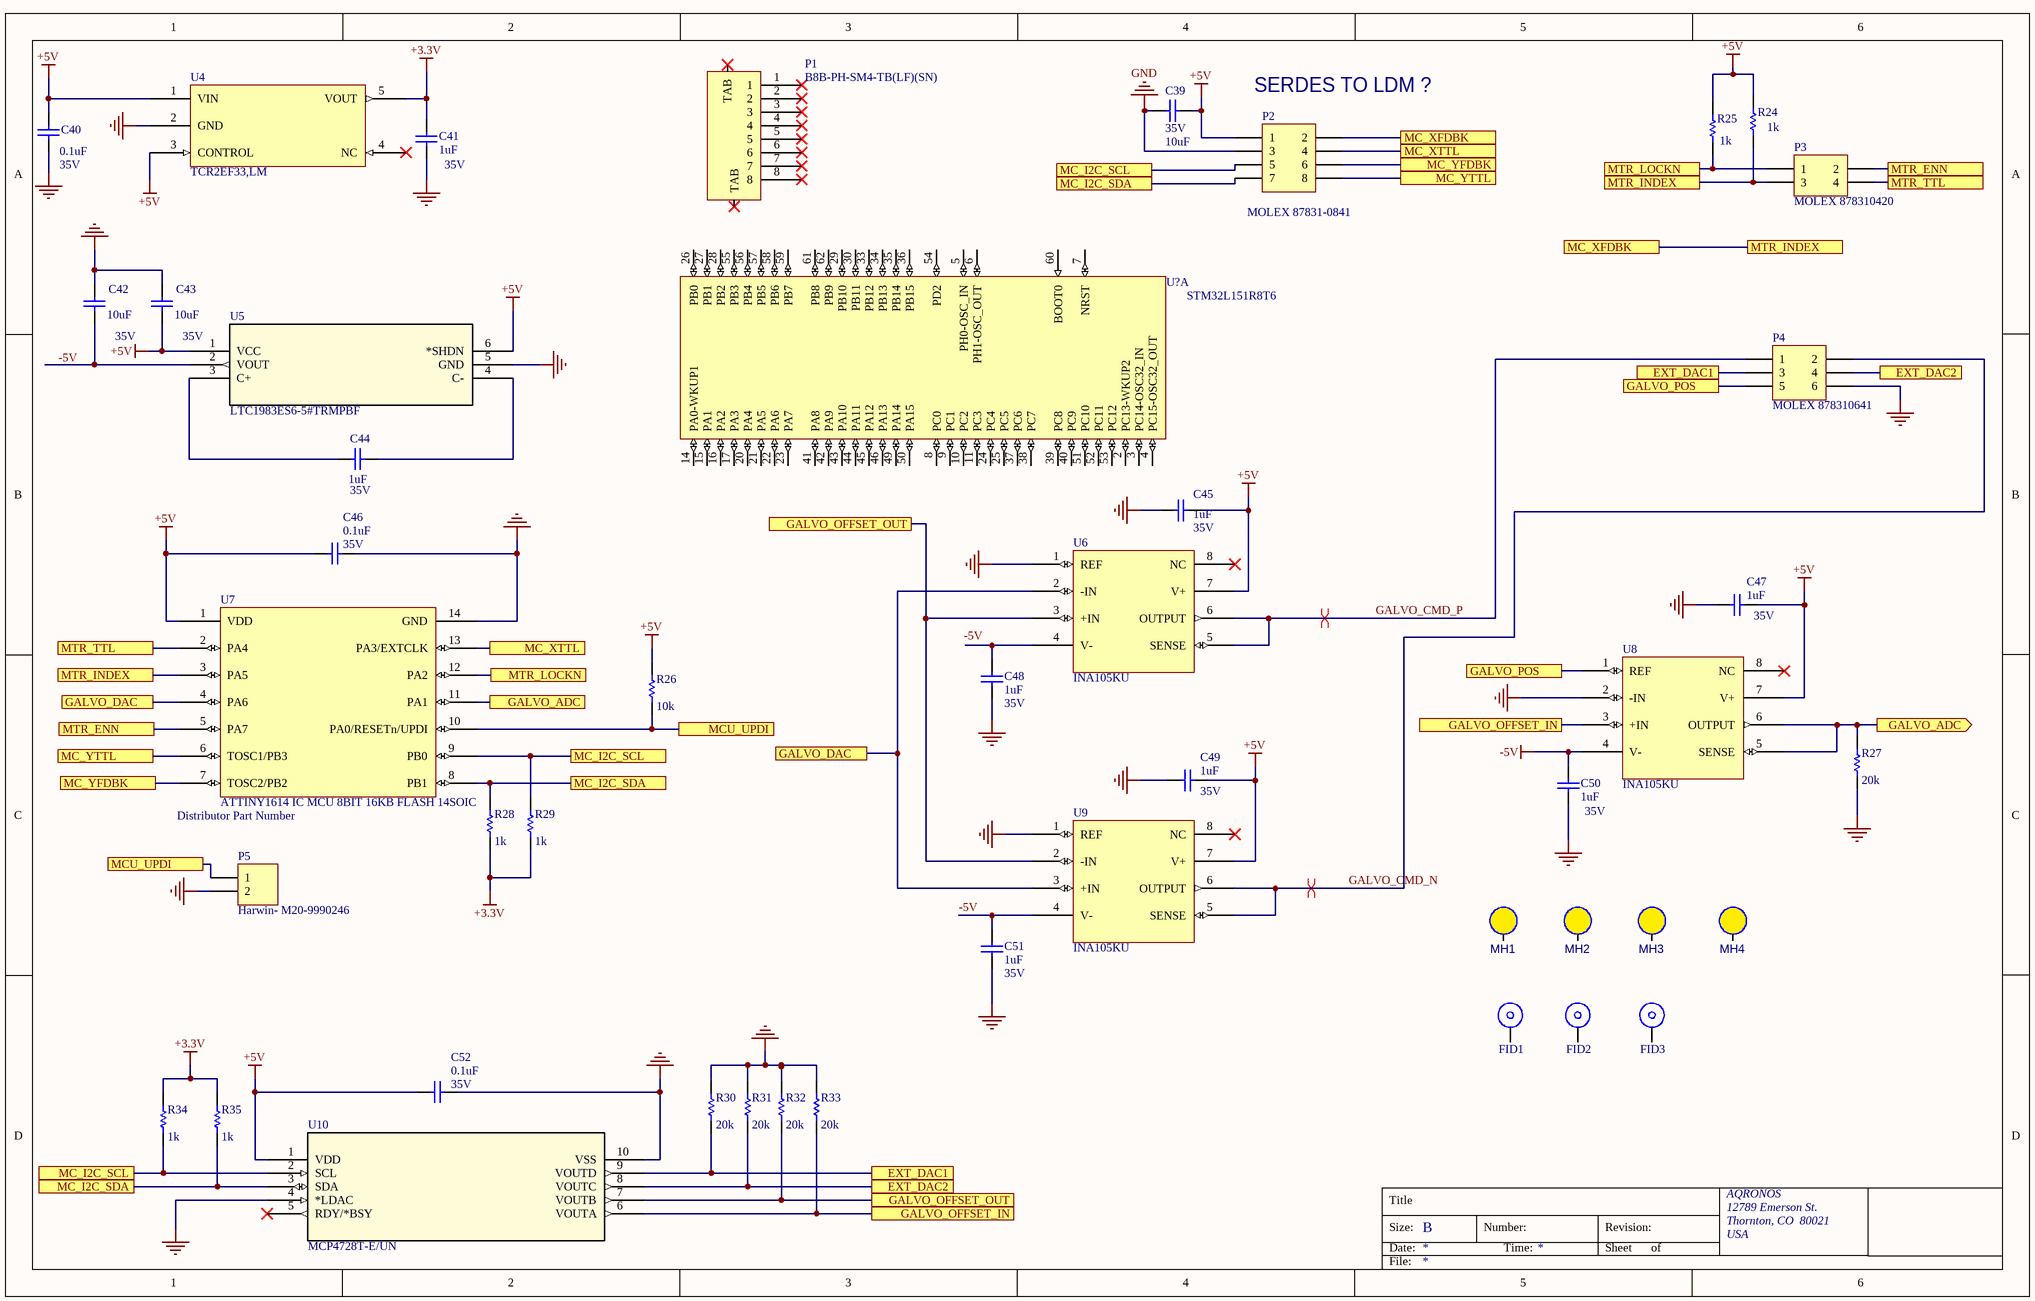
[diagram p3: -NEW-AQB-5-ANTON_TRANS-PWR_Motion-Controller.SchDoc]

### Parts
C39  value 10uF  Voltage: 35V  [CAP1206]  (hidden comment: Capacitor_non_pol)
C40  value 0.1uF  Voltage: 35V  [CAP0402]  (hidden comment: Capacitor_non_pol)
C41  value 1uF  Voltage: 35V  [CAP0402]  (hidden comment: Capacitor_non_pol)
C42  value 10uF  Voltage: 35V  [CAP1206]  (hidden comment: Capacitor_non_pol)
C43  value 10uF  Voltage: 35V  [CAP1206]  (hidden comment: Capacitor_non_pol)
C44  value 1uF  Voltage: 35V  [CAP0402]  (hidden comment: Capacitor_non_pol)
C45  value 1uF  Voltage: 35V  [CAP0402]  (hidden comment: Capacitor_non_pol)
C46  value 0.1uF  Voltage: 35V  [CAP0402]  (hidden comment: Capacitor_non_pol)
C47  value 1uF  Voltage: 35V  [CAP0402]  (hidden comment: Capacitor_non_pol)
C48  value 1uF  Voltage: 35V  [CAP0402]  (hidden comment: Capacitor_non_pol)
C49  value 1uF  Voltage: 35V  [CAP0402]  (hidden comment: Capacitor_non_pol)
C50  value 1uF  Voltage: 35V  [CAP0402]  (hidden comment: Capacitor_non_pol)
C51  value 1uF  Voltage: 35V  [CAP0402]  (hidden comment: Capacitor_non_pol)
C52  value 0.1uF  Voltage: 35V  [CAP0402]  (hidden comment: Capacitor_non_pol)
FID1  FIDUCIAL  [FID]  (value not drawn)
FID2  FIDUCIAL  [FID]  (value not drawn)
FID3  FIDUCIAL  [FID]  (value not drawn)
MH1  PAD-MH  [PAD-135Mils]  (value not drawn)
MH2  PAD-MH  [PAD-135Mils]  (value not drawn)
MH3  PAD-MH  [PAD-135Mils]  (value not drawn)
MH4  PAD-MH  [PAD-135Mils]  (value not drawn)
P1  B8B-PH-SM4-TB(LF)(SN)  [B8B-PH-SM4-TB(LF)(SN)]
P2  MOLEX 87831-0841  [HDR4X2-Molex]
P3  MOLEX 878310420  [HDR2X2-Molex]
P4  MOLEX 878310641  [HDR3X2-Molex]
P5  Harwin- M20-9990246  [HDR1X2]
R24  value 1k  [RES0402]  (hidden comment: Resistor)
R25  value 1k  [RES0402]  (hidden comment: Resistor)
R26  value 10k  [RES0402]  (hidden comment: Resistor)
R27  value 20k  [RES0402]  (hidden comment: Resistor)
R28  value 1k  [RES0402]  (hidden comment: Resistor)
R29  value 1k  [RES0402]  (hidden comment: Resistor)
R30  value 20k  [RES0402]  (hidden comment: Resistor)
R31  value 20k  [RES0402]  (hidden comment: Resistor)
R32  value 20k  [RES0402]  (hidden comment: Resistor)
R33  value 20k  [RES0402]  (hidden comment: Resistor)
R34  value 1k  [RES0402]  (hidden comment: Resistor)
R35  value 1k  [RES0402]  (hidden comment: Resistor)
U4  TCR2EF33,LM  [SOT-753]
U5  LTC1983ES6-5#TRMPBF  [SOT-23-6]
U6  INA105KU  [SOIC8]
U7  ATTINY1614 IC MCU 8BIT 16KB FLASH 14SOIC  [SOIC14]
U8  INA105KU  [SOIC8]
U9  INA105KU  [SOIC8]
U10  MCP4728T-E/UN  [MSOP10]
U?  STM32L151R8T6  [STM-LQFP64_N]  (part A of 2)

### Ports
EXT_DAC1, EXT_DAC2, GALVO_ADC, GALVO_ADC (out), GALVO_DAC, GALVO_OFFSET_IN, GALVO_OFFSET_OUT, GALVO_POS, MC_I2C_SCL, MC_I2C_SDA, MC_XFDBK, MC_XTTL, MC_YFDBK, MC_YTTL, MCU_UPDI, MTR_ENN, MTR_INDEX, MTR_LOCKN, MTR_TTL

### Nets
+3.3V: C41.1 R28.1 R29.1 R34.2 R35.2 U4.5(VOUT)
+5V: C39.2 C40.1 C43.2 C45.2 C46.2 C47.2 C49.2 C52.2 P2.1 R24.2 R25.2 R26.2 U4.1(VIN) U4.3(CONTROL) U5.1(VCC) U5.6(*SHDN) U6.7(V+) U7.1(VDD) U8.7(V+) U9.7(V+) U10.1(VDD)
-5V: C50.1 C51.1 U8.4(V-) U9.4(V-)
GND: C39.1 C40.2 C41.2 C42.1 C43.1 C45.1 C46.1 C47.1 C48.2 C49.1 C50.2 C51.2 C52.1 P2.3 P4.6 P5.2 R27.1 R30.2 R31.2 R32.2 R33.2 U4.2(GND) U5.5(GND) U6.1(REF) U7.14(GND) U8.2(-IN) U9.1(REF) U10.4(*LDAC) U10.10(VSS)
GALVO_CMD_N: P4.2 U9.5(SENSE) U9.6(OUTPUT)
GALVO_CMD_P: P4.1 U6.5(SENSE) U6.6(OUTPUT)
NetC42_2: C42.2 U5.2(VOUT)
NetC44_1: C44.1 U5.3(C+)
NetC44_2: C44.2 U5.4(C-)
NetC48_1: C48.1 U6.4(V-)
NetP2_2: P2.2 P3.3 R24.1 U7.3(PA5) ; port MC_XFDBK, port MTR_INDEX
NetP2_4: P2.4 U7.13(PA3/EXTCLK) ; port MC_XTTL
NetP2_5: P2.5 R29.2 R34.1 U7.9(PB0) U10.2(SCL) ; port MC_I2C_SCL
NetP2_6: P2.6 U7.7(TOSC2/PB2) ; port MC_YFDBK
NetP2_7: P2.7 R28.2 R35.1 U7.8(PB1) U10.3(SDA) ; port MC_I2C_SDA
NetP2_8: P2.8 U7.6(TOSC1/PB3) ; port MC_YTTL
NetP3_1: P3.1 R25.1 U7.12(PA2) ; port MTR_LOCKN
NetP3_2: P3.2 U7.5(PA7) ; port MTR_ENN
NetP3_4: P3.4 U7.2(PA4) ; port MTR_TTL
NetP4_3: P4.3 R30.1 U10.9(VOUTD) ; port EXT_DAC1
NetP4_4: P4.4 R31.1 U10.8(VOUTC) ; port EXT_DAC2
NetP4_5: P4.5 U8.1(REF) ; port GALVO_POS
NetP5_1: P5.1 R26.1 U7.10(PA0/RESETn/UPDI) ; port MCU_UPDI
NetR27_2: R27.2 U7.11(PA1) U8.5(SENSE) U8.6(OUTPUT) ; port GALVO_ADC
NetR32_1: R32.1 U6.3(+IN) U9.2(-IN) U10.7(VOUTB) ; port GALVO_OFFSET_OUT
NetR33_1: R33.1 U8.3(+IN) U10.6(VOUTA) ; port GALVO_OFFSET_IN
NetU6_2: U6.2(-IN) U7.4(PA6) U9.3(+IN) ; port GALVO_DAC

Not connected (* = marked no-connect by the designer): MH1 1; MH2 1; MH3 1; MH4 1; P1 1* 2* 3* 4* 5* 6* 7* 8* TAB*; U4 4(NC)*; U6 8(NC)*; U8 8(NC)*; U9 8(NC)*; U10 5(RDY/*BSY)*; U? 2(PC13-WKUP2) 3(PC14-OSC32_IN) 4(PC15-OSC32_OUT) 5(PH0-OSC_IN) 6(PH1-OSC_OUT) 7(NRST) 8(PC0) 9(PC1) 10(PC2) 11(PC3) 14(PA0-WKUP1) 15(PA1) 16(PA2) 17(PA3) 20(PA4) 21(PA5) 22(PA6) 23(PA7) 24(PC4) 25(PC5) 26(PB0) 27(PB1) 28(PB2) 29(PB10) 30(PB11) 33(PB12) 34(PB13) 35(PB14) 36(PB15) 37(PC6) 38(PC7) 39(PC8) 40(PC9) 41(PA8) 42(PA9) 43(PA10) 44(PA11) 45(PA12) 46(PA13) 49(PA14) 50(PA15) 51(PC10) 52(PC11) 53(PC12) 54(PD2) 55(PB3) 56(PB4) 57(PB5) 58(PB6) 59(PB7) 60(BOOT0) 61(PB8) 62(PB9)

### Layout directives
differential pair: GALVO_CMD_N, GALVO_CMD_P

### Notes on the sheet
- (near P2) SERDES TO LDM ?
- Title
- Size:
- Date:
- B
- Number:
- Time:
- Revision:
- Sheet
- of
- File:
- Labels drawn without touching a wire or pin: -5V
- (in symbol ATTINY1614-SSFR) Distributor Part Number

### Library data of the parts
C39 C42 C43 = Capacitor_non_pol: Manufacturer Part Number: CGA5L1X7R1V106K160AC; Distributor Part Number: 445-174428-1-ND; Footprint: *; P/N: *; Tolerance: *; Vendor: *; Manufacturer: *; Power: *; Current: *
C40 C46 C52 = Capacitor_non_pol: Manufacturer Part Number: GMK107B7104KAHT; Distributor Part Number: 587-3354-1-ND; P/N: *; Tolerance: *; Vendor: *; Manufacturer: *; Power: *; Current: *
  C40 C52: Footprint: 0402
C41 C44 C45 C47-C51 = Capacitor_non_pol: Manufacturer Part Number: GMK107AB7105KAHT; Distributor Part Number: 587-3352-1-ND; Footprint: *; P/N: *; Tolerance: *; Vendor: *; Manufacturer: *; Power: *; Current: *
FID1-FID3 = FID
MH1-MH4 = PAD-MH: PAD,MOUNTING HOLE
P1 = B8B-PH-SM4-TB(LF)(SN): 8 PIN JST SMT 2.0 MM PITCH; Value: CONN-8; Manufacturer Part Number: B8B-PH-SM4-TB(LF)(SN); Distributor Part Number: 455-1740-1-ND
P2 = HDR4x2-87831-0841: Connector Header Through Hole 8 position 0.079" (2.00mm); Manufacturer Part Number: 0878310841; Digi-Key Part Number: WM8611-ND; Footprint: HDR4x2-Molex; P/N: *; Tolerance: *; Value: *; Vendor: Molex; Distributor Part Number: WM8611-ND
P3 = HDR2x2-878310420: Connector Header Through Hole 4 position 0.079" (2.00mm); Manufacturer Part Number: 87831-0420; Digi-Key Part Number: WM18557-ND; Footprint: HDR2x2-Molex; P/N: *; Tolerance: *; Value: *; Vendor: Molex; Distributor Part Number: WM18557-ND
P4 = HDR3x2-878310641: Connector Header Through Hole 6 position 0.079" (2.00mm); Digi-Key Part Number: WM3590-ND; Footprint: HDR3x2-Molex; Manufacturer Part Number: 878310641; P/N: *; Tolerance: *; Value: *; Vendor: Molex; Distributor Part Number: WM3590-ND
P5 = HDR1x2-M20-9990246: Connector Header Through Hole 2 position 0.100" (2.54mm); Value: CONN-2; Vendor: Harwin Inc.; Digi-Key Part Number: 952-2262-ND; Manufacturer Part Number: M20-9990246; Tolerance: *; Distributor Part Number: 952-2262-ND
R24 R25 R28 R29 R34 R35 = Resistor: Manufacturer Part Number: ERJ-2GEJ102X; Digi-Key Part Number: *; P/N: *; Tolerance: *; Vendor: *; Voltage: *; Power: *; Current: *; Distributor Part Number: P1.0KJCT-ND
  R24 R25 R35: Footprint: *; HelpURL: *
  R29 R34: HelpURL: *; Distributor Part Number: *
R26 = Resistor: Manufacturer Part Number: ERJ-2GEJ103X; Digi-Key Part Number: *; HelpURL: *; P/N: *; Tolerance: *; Vendor: *; Voltage: *; Power: *; Current: *; Distributor Part Number: P10KJCT-ND
R27 R30-R33 = Resistor: Manufacturer Part Number: ERJ-2RKF2002X; Digi-Key Part Number: *; Footprint: *; HelpURL: *; P/N: *; Tolerance: *; Vendor: *; Voltage: *; Power: *; Current: *; Distributor Part Number: P20.0KLCT-ND
U4 = TCR2EF33,LM: Linear Voltage Regulator IC Positive Fixed 1 Output 200mA SMV; Manufacturer Part Number: TCR2EF33,LM(CT; Vendor: Toshiba Semiconductor and Storage; P/N: *; HelpURL: *; Tolerance: *; Value: *; Digikey Part Number: TCR2EF33LM(CTTR-ND; Distributor Part Number: TCR2EF33LM(CTTR-ND
U5 = LTC1983ES6-5#TRM: Charge Pump Switching Regulator IC Negative Fixed -5V 1 Output 100mA SOT-23-6 Thin, TSOT-23-6; Vendor: Linear Technology/Analog Devices; Manufacturer Part Number: LTC1983ES6-5#TRMPBF; Value: *; HelpURL: *; P/N: *; Footprint: SOT-23_S6; Tolerance: *; Distributor Part Number: LTC1983ES6-5#TRMPBFCT-ND
U6 U8 U9 = INA105: IC OPAMP DIFFERENTIAL 1MHZ 8SOIC; Vendor: Texas Instruments; Tolerance: *; Value: *; Voltage: *; Digi-Key Part Number: 296-44407-5-ND; Manufacturer Part Number: INA105KU; Distributor Part Number: 296-44407-5-ND
U7 = ATTINY1614-SSFR: AVR tinyAVR™ 1 Microcontroller IC 8-Bit 20MHz 16KB (16K x 8) FLASH 14-SOIC; Vendor: Microchip Technology; Value: *; P/N: *; Tolerance: *; HelpURL: *; Digi-Key Part Number: ATTINY1614-SSFRCT-ND; Manufacturer Part Number: ATTINY1614-SSFR; Distributor Part Number: ATTINY1614-SSFRCT-ND; Distributor Part Number: *
U10 = MCP4728T-E/UN: 12 Bit Digital to Analog Converter 4 10-MSOP; Vendor: Microchip Technology; Manufacturer Part Number: MCP4728T-E/UN; Value: *; Digi-Key Part Number: MCP4728T-E/UNTR-ND; P/N: *; Tolerance: *; Distributor Part Number: MCP4728T-E/UNTR-ND
U? = STM32L151R8T6: ARM Cortex-M3 32-bit MCU, 64 KB Flash, 10 KB Internal RAM, 51 I/Os, 64-pin LQFP, -40 to 85 degC, Tray; Manufacturer: STMicroelectronics; D/A Converter: 2x12-bit (2 Channel); Data E2PROM nom (B): 4096; FLASH Size (Prog) (kB): 64; I/Os (High Current): 51; Internal RAM Size (kB): 10; Operating Frequency(F) (Processor speed) (MHz): 32; Supply Voltage(Vcc) min (V): 1.65; DatasheetVersion: Rev. 8; PackageVersion: Rev. 4, 06/2013; PackageReference: LQFP64; PackageDescription: 64-Pin Low Profile Quad Flat Package, 10 x 10 mm Body, 0.5 mm Pitch; Core: ARM Cortex-M3; Packing: Tray; Mounting Technology: Surface Mount; PartNumber: STM32L151R8T6; ComponentLink1Description: Manufacturer URL; ComponentLink1URL: http://www.st.com/web/en/home.html; ComponentLink2Description: Datasheet; ComponentLink2URL: http://www.st.com/st-web-ui/static/active/en/resource/technical/document/datasheet/CD00277537.pdf; ComponentLink3Description: Package Specification; ComponentLink3URL: http://www.st.com/st-web-ui/static/active/en/resource/technical/document/datasheet/DM00037051.pdf

## Nets that join several sheets
+5V: -NEW_AQB-5-ANTON_TRANS-PWR-TVS (C59.1 U12.6 U12.7), -NEW-AQB-5-ANTON_TRANS-PWR_Motion-Controller (21 pins)
GND: -NEW_AQB-5-ANTON_TRANS-PWR-TVS (9 pins), -NEW-AQB-5-ANTON_TRANS-PWR-GALVO (20 pins), -NEW-AQB-5-ANTON_TRANS-PWR-POLYGON (19 pins), -NEW-AQB-5-ANTON_TRANS-PWR_Motion-Controller (29 pins)
VBAT_FILT: -NEW_AQB-5-ANTON_TRANS-PWR-TVS (C53.1 F5.1 L4.2), -NEW-AQB-5-ANTON_TRANS-PWR-GALVO (F2.1 F3.1), -NEW-AQB-5-ANTON_TRANS-PWR-POLYGON (F4.1)